# Altium project TSAV Updated UCM ISO.PrjPcb
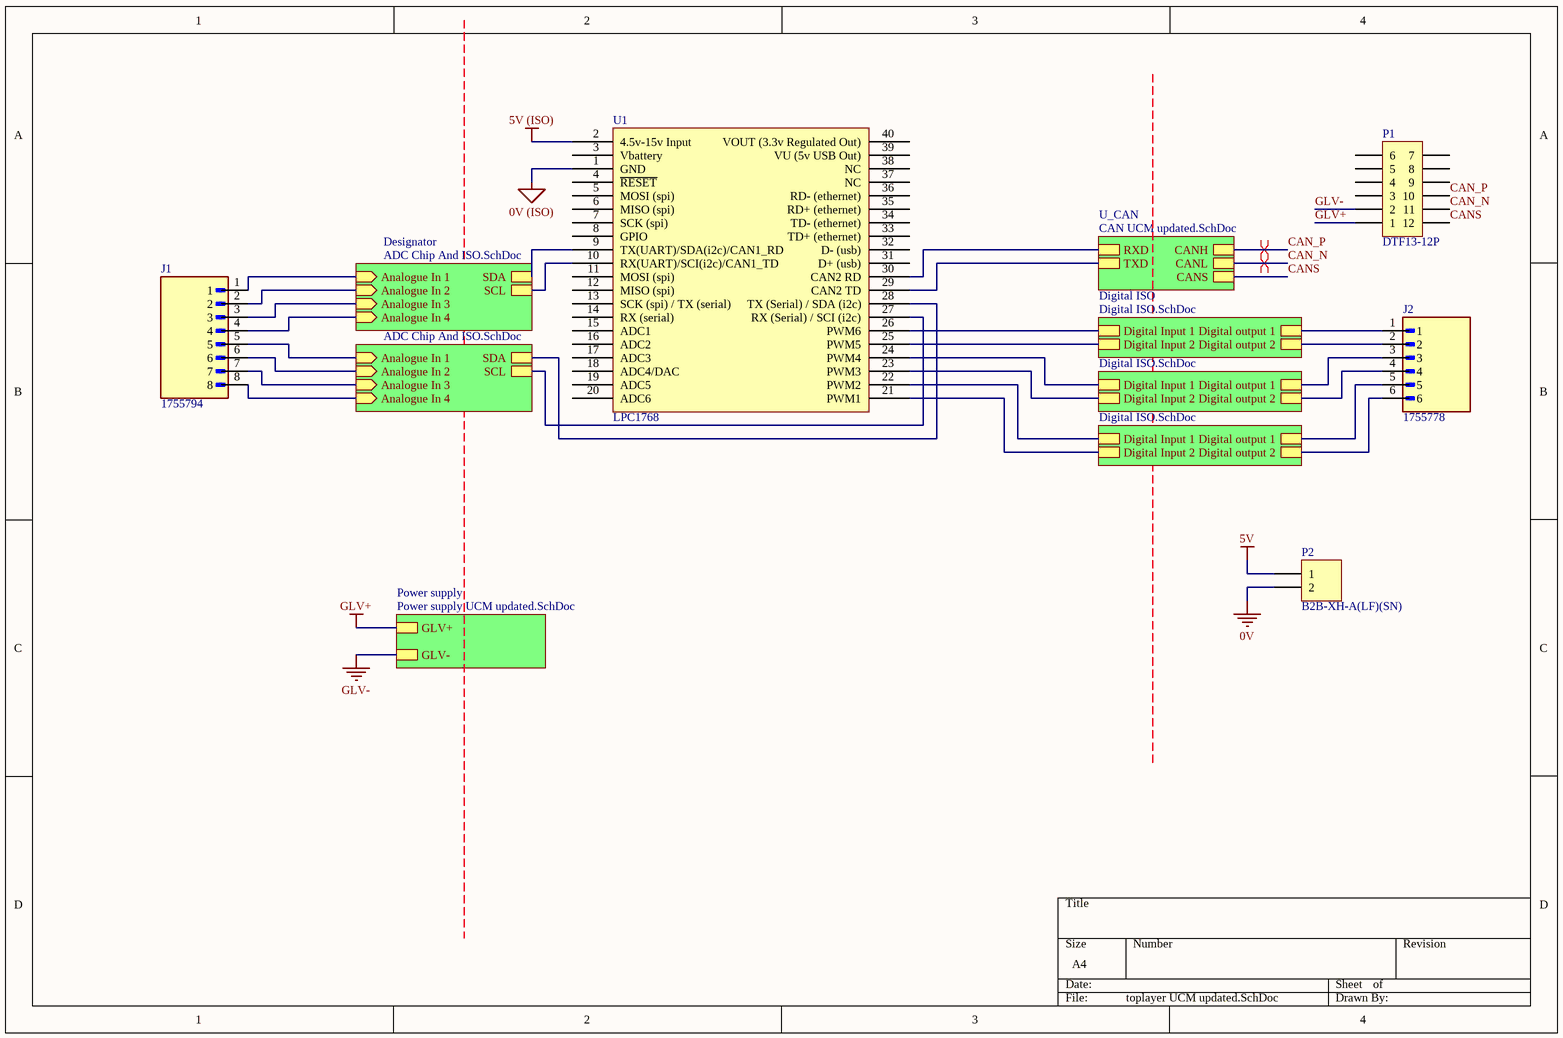
[diagram p0: toplayer UCM updated.SchDoc]
5 sheets, 135 parts. Net scope: hierarchical (ports join the sheet entries above them; power ports are global).
Board file: TSAV UPDATED UCM ISO.PcbDoc
Sheets:
  toplayer UCM updated.SchDoc
    U_CAN = CAN UCM updated.SchDoc
    Power supply = Power supply UCM updated.SchDoc
    Designator = Digital ISO.SchDoc
    Designator = ADC Chip And ISO.SchDoc
    Designator = ADC Chip And ISO.SchDoc
    Digital ISO = Digital ISO.SchDoc
    Digital ISO = Digital ISO.SchDoc

## Sheet toplayer UCM updated.SchDoc
size A4; SheetNumber: 1; SheetTotal: 5

### Parts
J1  1755794  [PHOENIX_1755794]
J2  1755778  [PHOENIX_1755778]
P1  DTF13-12P  [DTF13-12P]
P2  B2B-XH-A(LF)(SN)  [XH 2 PIN VERT]
U1  LPC1768  [LPC1768]

### Sub-sheets
Designator = Digital ISO.SchDoc: Digital Input 1, Digital Input 2, Digital output 1, Digital output 2
Designator = ADC Chip And ISO.SchDoc: Analogue In 1 (in), Analogue In 2 (in), SDA, SCL, Analogue In 3 (in), Analogue In 4 (in)
Designator = ADC Chip And ISO.SchDoc: Analogue In 1 (in), Analogue In 2 (in), SDA, SCL, Analogue In 3 (in), Analogue In 4 (in)
Digital ISO = Digital ISO.SchDoc: Digital Input 1, Digital Input 2, Digital output 1, Digital output 2
Digital ISO = Digital ISO.SchDoc: Digital Input 1, Digital Input 2, Digital output 1, Digital output 2
Power supply = Power supply UCM updated.SchDoc: GLV+, GLV-
U_CAN = CAN UCM updated.SchDoc: RXD, TXD, CANH, CANL, CANS

### Nets
0V: P2.2
0V (ISO): U1.1(GND)
5V: P2.1
5V (ISO): U1.2(4.5v-15v_Input)
GLV+: P1.1 ; sheet Power supply/GLV+
GLV-: P1.2 ; sheet Power supply/GLV-
CAN_N: P1.11 ; sheet U_CAN/CANL
CAN_P: P1.10 ; sheet U_CAN/CANH
CANS: P1.12 ; sheet U_CAN/CANS
NetC33_Designator#1_2: J1.1 ; sheet Designator/Analogue In 1
NetC33_Designator#2_2: J1.5 ; sheet Designator/Analogue In 1
NetC34_Designator#1_2: J1.2 ; sheet Designator/Analogue In 2
NetC34_Designator#2_2: J1.6 ; sheet Designator/Analogue In 2
NetC35_Designator#1_2: J1.4 ; sheet Designator/Analogue In 4
NetC35_Designator#2_2: J1.8 ; sheet Designator/Analogue In 4
NetC36_Designator#1_2: J1.3 ; sheet Designator/Analogue In 3
NetC36_Designator#2_2: J1.7 ; sheet Designator/Analogue In 3
NetJ2_1: J2.1 ; sheet Digital ISO/Digital output 1
NetJ2_2: J2.2 ; sheet Digital ISO/Digital output 2
NetJ2_3: J2.3 ; sheet Digital ISO/Digital output 1
NetJ2_4: J2.4 ; sheet Digital ISO/Digital output 2
NetJ2_5: J2.5 ; sheet Designator/Digital output 1
NetJ2_6: J2.6 ; sheet Designator/Digital output 2
NetR7_Designator_1: U1.22(PWM2) ; sheet Designator/Digital Input 1
NetR7_Digital_ISO#1_1: U1.24(PWM4) ; sheet Digital ISO/Digital Input 1
NetR7_Digital_ISO#2_1: U1.26(PWM6) ; sheet Digital ISO/Digital Input 1
NetR8_Designator#1_1: U1.9(TX(UART)/SDA(i2c)/CAN1_RD) ; sheet Designator/SDA
NetR8_Designator#2_1: U1.28(TX_(Serial)_/_SDA_(i2c)) ; sheet Designator/SDA
NetR9_Designator#1_1: U1.10(RX(UART)/SCI(i2c)/CAN1_TD) ; sheet Designator/SCL
NetR9_Designator#2_1: U1.27(RX_(Serial)_/_SCI_(i2c)) ; sheet Designator/SCL
NetR26_Designator_1: U1.21(PWM1) ; sheet Designator/Digital Input 2
NetR26_Digital_ISO#1_1: U1.23(PWM3) ; sheet Digital ISO/Digital Input 2
NetR26_Digital_ISO#2_1: U1.25(PWM5) ; sheet Digital ISO/Digital Input 2
NetU1_29: U1.29(CAN2_TD) ; sheet U_CAN/TXD
NetU1_30: U1.30(CAN2_RD) ; sheet U_CAN/RXD

Not connected (* = marked no-connect by the designer): P1 3 4 5 6 7 8 9; U1 3(Vbattery) 4(~{RESET}) 5(MOSI_(spi)) 6(MISO_(spi)) 7(SCK_(spi)) 8(GPIO) 11(MOSI_(spi)) 12(MISO_(spi)) 13(SCK_(spi)_/_TX_(serial)) 14(RX_(serial)) 15(ADC1) 16(ADC2) 17(ADC3) 18(ADC4/DAC) 19(ADC5) 20(ADC6) 31(D+_(usb)) 32(D-_(usb)) 33(TD+_(ethernet)) 34(TD-_(ethernet)) 35(RD+_(ethernet)) 36(RD-_(ethernet)) 37(NC) 38(NC) 39(VU_(5v_USB_Out)) 40(VOUT_(3.3v_Regulated_Out))

### Layout directives
differential pair: CAN_N, CAN_P

### Library data of the parts
J1 = 1755794: Pluggable Header 5.08mm 12AWG 320V 12A 8 Position COMBICON MSTBVA Series | Phoenix Contact 1755794; SnapEDA_Link: https://www.snapeda.com/parts/1755794/Phoenix+Contact/view-part/?ref=snap; Package: None; Value: *; MF: Phoenix Contact; MP: 1755794; Check_prices: https://www.snapeda.com/parts/1755794/Phoenix+Contact/view-part/?ref=eda
J2 = 1755778: Pluggable Header 5.08mm 12AWG 320V 12A 6 Position COMBICON MSTBVA Series | Phoenix Contact 1755778; SnapEDA_Link: https://www.snapeda.com/parts/1755778/Phoenix+Contact/view-part/?ref=snap; Package: None; Value: *; MF: Phoenix Contact; MP: 1755778; Check_prices: https://www.snapeda.com/parts/1755778/Phoenix+Contact/view-part/?ref=eda
P1 = DTF13-12P: Positions: 12; Pitch: 4.45mm; Angle: 90; Flange: No; Contact: Copper Alloy; Part Number: DTF13-12P; Row Spacing: 4.45mm; Digikey Part Number: 1734-1861-ND; Digikey Link: https://www.digikey.com/products/en?keywords=dtf13-12pa
P2 = B2B-XH-A(LF)(SN): Positions: 2; Pitch: 2.54mm; Angle: 0; Flange: No; Contact: Tin; Part Number: B2B-XH-A(LF)(SN); Row Spacing: 2.54mm; Digikey Part Number: 455-2247-ND; Digikey Link: https://www.digikey.com.au/en/products/detail/jst-sales-america-inc/B2B-XH-A-LF-SN/1651045
U1 = LPC1768: Mbed Development Board LPC1768; Complex IC: 1; Part Number: LPC1768; Manufacturer: MBED

## Sheet CAN UCM updated.SchDoc
size A4; SheetNumber: 2; SheetTotal: 5
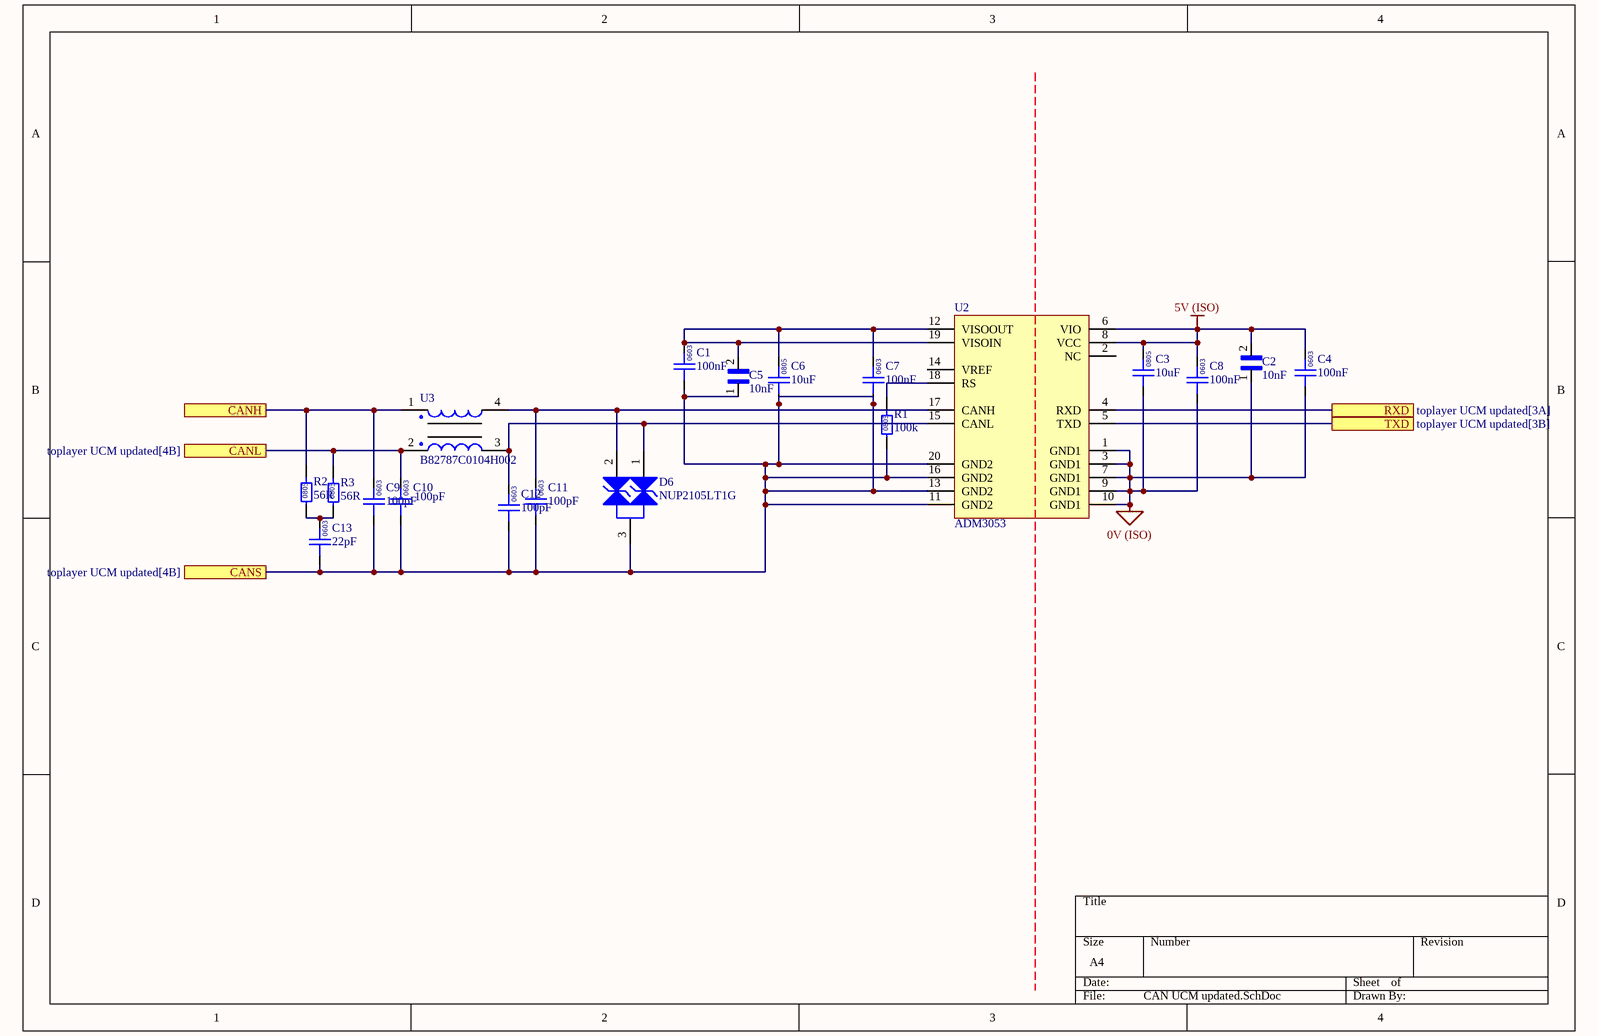
[diagram p1: CAN UCM updated.SchDoc]

### Parts
C1  100nF  [0603]
C2  10nF  [CAPC3216X95N]
C3  10uF  [0805]
C4  100nF  [0603]
C5  10nF  [CAPC3216X95N]
C6  10uF  [0805]
C7  100nF  [0603]
C8  100nF  [0603]
C9  100pF  [0603]
C10  100pF  [0603]
C11  100pF  [0603]
C12  100pF  [0603]
C13  22pF  [0603]
D6  NUP2105LT1G  [ONSC-SOT-23-3-318-08_V]
R1  100k  [0805]
R2  56R  [0805]
R3  56R  [0805]
U2  ADM3053  [AD SOIC-W 20]
U3  B82787C0104H002  [TDK 4-PC Pad]

### Ports
CANH (see toplayer UCM updated[4A]), CANL (see toplayer UCM updated[4B]), CANS (see toplayer UCM updated[4B]), RXD (see toplayer UCM updated[3A]), TXD (see toplayer UCM updated[3B])

### Nets
0V (ISO): C2.1 C3.1 C4.1 C8.1 U2.1(GND1) U2.3(GND1) U2.7(GND1) U2.9(GND1) U2.10(GND1)
5V (ISO): C2.2 C3.2 C4.2 C8.2 U2.6(VIO) U2.8(VCC)
CAN_N: C10.2 R3.2 U3.2 ; port CANL
CAN_P: C9.2 R2.2 U3.1 ; port CANH
CANS: C1.1 C5.1 C6.1 C7.1 C9.1 C10.1 C11.1 C12.1 C13.1 D6.3(K) R1.1 U2.11(GND2) U2.13(GND2) U2.16(GND2) U2.20(GND2) ; port CANS
NetC1_2: C1.2 C5.2 C6.2 C7.2 U2.12(VISOOUT) U2.19(VISOIN)
NetC11_2: C11.2 D6.2(K) U2.17(CANH) U3.4
NetC12_2: C12.2 D6.1(K) U2.15(CANL) U3.3
NetC13_2: C13.2 R2.1 R3.1
NetR1_2: R1.2 U2.18(RS)
NetU1_29: U2.5(TXD) ; port TXD
NetU1_30: U2.4(RXD) ; port RXD

Not connected (* = marked no-connect by the designer): U2 2(NC) 14(VREF)

### Notes on the sheet
- (in symbol GCM188L81H104KA57D) 0603
- (in symbol GRM21BR6YA106KE43L) 0805
- (in symbol GRM0335C1H220JA01D) 0603
- (in symbol GRM1885C1H101JA01D) 0603
- (in symbol RC0805FR0756RL) 0805
- (in symbol RC0805FR07100KL) 0805

### Library data of the parts
C1 C4 C7 C8 = GCM188L81H104KA57D: Manufacturer: muRata; Rated Voltage: 50V; Tolerance: ±10%; Material: MLCC; Temperature Rating: X8L; Part Number: GCM188L81H104KA57D; Value: 100nF; Digikey Part Number: 490-6049-1-ND
C2 C5 = GCM3195C2A103JA16D: 1206 0.01 uF 100 V Â±5% Tolerance C0G SMT Multilayer Ceramic Capacitor; MF: Murata Electronics; Check_prices: https://www.snapeda.com/parts/GCM3195C2A103JA16D/Murata%20Electronics%20North%20America/view-part/1773285/?ref=eda; Package: 3216 Murata; MP: GCM3195C2A103JA16D; Value: *; Availability: In Stock; SnapEDA_Link: https://www.snapeda.com/parts/GCM3195C2A103JA16D/Murata%20Electronics%20North%20America/view-part/1773285/?ref=snap; Price: None
C3 C6 = GRM21BR6YA106KE43L: Manufacturer: muRata; Rated Voltage: 50V; Tolerance: 10%; Material: MLCC; Temperature Rating: X5R; Part Number: GRM21BR6YA106KE43L; Value: 10uF; Digikey Part Number: 490-10514-6-ND
C9-C12 = GRM1885C1H101JA01D: Manufacturer: Murata Electronics; Rated Voltage: 50V; Tolerance: ±5%; Material: MLCC; Temperature Rating: C0G, NP0; Part Number: GRM1885C1H101JA01D; Value: 100pF; Digikey Part Number: 490-1427-1-ND
C13 = GRM0335C1H220JA01D: Manufacturer: Murata Electronics; Rated Voltage: 50V; Tolerance: ±5%; Material: MLCC; Temperature Rating: C0G, NP0; Part Number: GRM0335C1H220JA01D; Value: 22pF; Digikey Part Number: 490-6123-1-ND
D6 = CMP-1063-00164-1: Dual Line CAN Bus Protector, 3-Pin SOT-23, Pb-Free, Tape and Reel; Manufacturer: On Semiconductor; IR Max (uA): 0.1; Number of Lines: 2; Direction: Bidirectional; C Max (pF): 30; PPK Max (W): 350; V(BR) Min (V): 26.2; ComponentLink3URL: http://www.onsemi.cn/pub_link/Collateral/318-08.PDF; Mounting Technology: Surface Mount; ComponentLink2Description: Datasheet; PartNumber: NUP2105LT1G; ComponentLink1URL: http://www.onsemi.com/; PackageVersion: Rev. AP, 11/2009; DatasheetVersion: Rev. 5; RoHS: Pb-Free; PackageReference: SOT-23-3-318-08; ComponentLink2URL: http://www.onsemi.cn/pub_link/Collateral/NUP2105L-D.PDF; ComponentLink1Description: Manufacturer URL; PackageDescription: 3-Pin Small Outline Transistor, Body 2.92 x 1.3 mm, Pitch 0.95 mm; Packing: Tape and Reel; ComponentLink3Description: Package Specification
R1 = RC0805FR07100KL: Manufacturer: YAGEO; Tolerance: 0.01; Rated Power: 0.125W; Part Number: RC0805FR07100KL; Value: 100k; Material: FR-07; Digikey Part Number: 311-100KCRCT-ND
R2 R3 = RC0805FR0756RL: Manufacturer: YAGEO; Tolerance: 0.01; Rated Power: 0.125W; Part Number: RC0805FR0756RL; Value: 56R; Material: FR-07; Digikey Part Number: 311-56.0CRCT-ND
U2 = ADM3053: Isolated CAN Transceiver; Manufacturer: Analogue Devices; Complex IC: 1; Part Number: ADM3053; Digikey Part Number: ADM3053BRWZ-ND; Digikey Link: https://www.digikey.com/product-detail/en/analog-devices-inc/ADM3053BRWZ/ADM3053BRWZ-ND/2709332
U3 = B82787C0104H002: Manufacturer: EPCOS (TDK); Value: 100µH @ 100kHz; Impedance: 5.8 kOhms @ 10MHz; Rated Current: 150mA; Part Number: B82787C0104H002; Material: Wirewound; Digikey Part Number: 495-4598-1-ND

## Sheet Power supply UCM updated.SchDoc
size A4; SheetNumber: 3; SheetTotal: 5
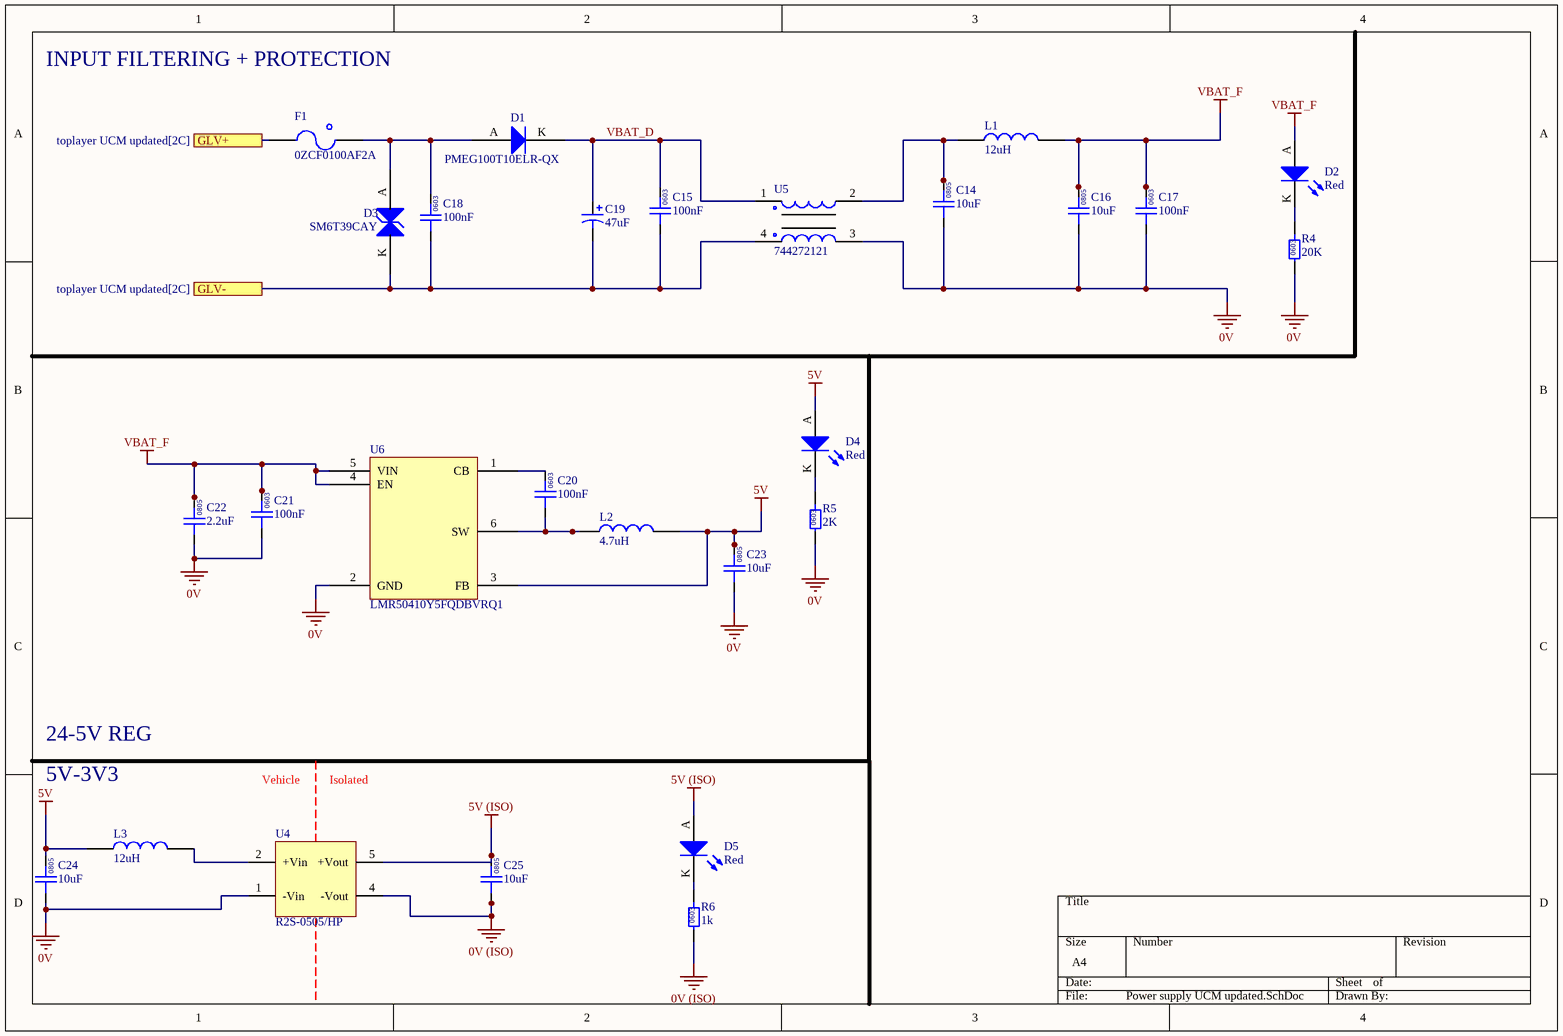
[diagram p2: Power supply UCM updated.SchDoc]

### Parts
C14  10uF  [0805]
C15  100nF  [0603]
C16  10uF  [0805]
C17  100nF  [0603]
C18  100nF  [0603]
C19  47uF  [CHEMI-CON ELCO]
C20  100nF  [0603]
C21  100nF  [0603]
C22  2.2uF  [0805]
C23  10uF  [0805]
C24  10uF  [0805]
C25  10uF  [0805]
D1  PMEG100T10ELR-QX  [SODFL350X110-2N]
D2  Red  [0805 LED]
D3  SM6T39CAY  [SM6T39CAY-Footprint-1]
D4  Red  [0805 LED]
D5  Red  [0805 LED]
F1  0ZCF0100AF2A  [2920]
L1  12uH  [1812]
L2  4.7uH  [SRN3015TA-4R7M]
L3  12uH  [1812]
R4  20K  [0603]
R5  2K  [0603]
R6  1k  [0603]
U4  R2S-0505/HP  [RECOM 8-SMD (5 Pin)]
U5  744272121  [Wurth 4-PC Pad]
U6  LMR50410Y5FQDBVRQ1  [TI-SOT23-6]

### Ports
GLV+ (see toplayer UCM updated[2C]), GLV- (see toplayer UCM updated[2C])

### Nets
0V: C14.1 C16.1 C17.1 C21.1 C22.1 C23.1 C24.1 R4.1 R5.1 U4.1(-Vin) U5.3 U6.2(GND)
0V (ISO): C25.1 R6.1 U4.4(-Vout)
5V: C23.2 C24.2 D4.A L2.1 L3.2 U6.3(FB)
5V (ISO): C25.2 D5.A U4.5(+Vout)
GLV+: F1.1 ; port GLV+
GLV-: C15.1 C18.1 C19.1 D3.K U5.4 ; port GLV-
VBAT_F: C16.2 C17.2 C21.2 C22.2 D2.A L1.1 U6.4(EN) U6.5(VIN)
VBAT_D: C15.2 C19.2 D1.K U5.1
NetC14_2: C14.2 L1.2 U5.2
NetC18_2: C18.2 D1.A D3.A F1.2
NetC20_1: C20.1 L2.2 U6.6(SW)
NetC20_2: C20.2 U6.1(CB)
NetD2_K: D2.K R4.2
NetD4_K: D4.K R5.2
NetD5_K: D5.K R6.2
NetL3_1: L3.1 U4.2(+Vin)

### Notes on the sheet
- INPUT FILTERING + PROTECTION
- 24-5V REG
- 5V-3V3
- Vehicle
- Isolated
- (in symbol GCM188L81H104KA57D) 0603
- (in symbol GRM21BR6YA106KE43L) 0805
- (in symbol GRM21BR61A226ME51L) 0805
- (in symbol RC0603FR-071KL) 0603
- (in symbol RC0603FR-072KL) 0603
- (in symbol RC0603FR-0720KL) 0603

### Library data of the parts
C14 C16 C23-C25 = GRM21BR6YA106KE43L: as C3 on sheet CAN UCM updated; Part Number: GRM21BR6YA106KE43L; Value: 10uF; Digikey Part Number: 490-10514-6-ND
C15 C17 C18 C20 C21 = GCM188L81H104KA57D: as C1 on sheet CAN UCM updated; Part Number: GCM188L81H104KA57D; Value: 100nF; Digikey Part Number: 490-6049-1-ND
C19 = HHXA350ARA470MF61G: Part Number: HHXA350ARA470MF61G
C22 = GRM21BR61A226ME51L: Manufacturer: muRata; Value: 22uF; Rated Voltage: 50V; Tolerance: 20%; Material: MLCC; Temperature Rating: X5R; Part Number: GRM21BR61A226ME51L; Digikey Part Number: 490-10511-1-ND
D1 = CMP-004-00005-4: Diode 100 V 1A Surface Mount SOD-123W
D2 D4 D5 = SML-210LTT86: Red LED Indication - Discrete 1.75V 0805 (2012 Metric); Manufacturer: ROHM Semiconductor; Part Number: SML-210LTT86; Colour: Red; Digikey Part Number: 511-1286-1-ND
D3 = CMP-004-00003-4: TVS Diode Single Bi-Dir 33.3V 600W Automotive 2-Pin SMB T/R / TVS DIODE 33.3VWM 69.7VC SMB; Peak Pulse Current: 57A; Polarity: Bidirectional; Min Breakdown Voltage: 37.1V; Test Current: 1mA; Number of Elements: 1; Operating Supply Voltage: 30V; Diode Type: ZENER; Clamping Voltage: 53.9V; Leakage Current: 200nA; Power Line Protection: No; Max Surge Current: 11.1A; Max Breakdown Voltage: 41V; Breakdown Voltage: 39V; Max Power Dissipation: 600W; Radiation Hardening: No; Resistor Type: Zener; Termination: SMD/SMT; REACH SVHC: No SVHC; Reverse Breakdown Voltage: 37.1V; Max Operating Temperature: 150°C; Min Operating Temperature: -55°C; Element Configuration: Single; Length: 4.6mm; Case/Package: DO-214AA; Reverse Standoff Voltage: 33.3V; Number of Bidirectional Channels: 1; Number of Pins: 2; Direction: Bidirectional; Mount: Surface Mount; Package Quantity: 1; Width: 3.95mm; RoHS Compliant: Yes; Number of Channels: 1; Packaging: Tape and Reel; Max Reverse Leakage Current: 200nA; Peak Pulse Power: 600W; Height: 2.45mm; Series: Automotive, AEC-Q101, SM6TY, TRANSIL™
F1 = 0ZCF0100AF2A: PTC RESET FUSE 60V 1A 292; Manufacturer: Littelfuse Inc.; Part Number: 0ZCF0100AF2A; Digikey Part Number: 507-2070-1-ND; Digikey Link: https://www.digikey.com/product-detail/en/bel-fuse-inc/0ZCF0100AF2A/507-2070-1-ND/6210547
L1 L3 = RLS-126: Manufacturer: Recom; Tolerance: 0.2; Impedance: 230mOhm; Rated Current: 0.8 A; Material: Wirewound; Part Number: RLS-126; Value: 12uH; Digikey Part Number: 945-3429-ND
L2 = SRN4018-4R7M: Manufacturer: Bourns; Tolerance: 0.2; Impedance: 84mOhms; Rated Current: 1.9A; Material: Wirewound; Part Number: SRN4018-4R7M; Value: 4.7uH; Digikey Part Number: SRN3015TA-4R7MCT-ND
R4 = RC0603FR-0720KL: Manufacturer: YAGEO; Tolerance: 0.01; Rated Power: 0.1W; Part Number: RC0603FR-0720KL; Value: 20K; Digikey Part Number: 311-20.0KHRCT-ND; Material: FR-07
R5 = RC0603FR-072KL: Manufacturer: YAGEO; Tolerance: 0.01; Rated Power: 0.1W; Part Number: RC0603FR-072KL; Value: 2K; Digikey Part Number: 311-2.00KHRCT-ND; Material: FR-07
R6 = RC0603FR-071KL: Manufacturer: YAGEO; Tolerance: 0.01; Rated Power: 0.1W; Part Number: RC0603FR-071KL; Value: 1k; Digikey Part Number: 311-1.00KHRCT-ND; Material: FR-07
U4 = R2S-0505/HP: Isolated Module DC DC Converter 1 Output 5V 606mA 4.5V - 5.5V Input; Manufacturer: Recom; Output Power: 2W; Efficiency: 0.85; Part Number: R2S-0505/HP; Input Voltage: 4.5V-5.5V; Output Voltage: 5V; Isolation: Isolated; Digikey Part Number: 945-1764-5-ND; Digikey Link: https://www.digikey.com/product-detail/en/recom-power/R2S-0505-HP/945-1764-5-ND/2302761
U5 = 744272121: Manufacturer: Wurth Electronics Inc; Value: 120uH @ 100kHz; Impedance: 460 Ohms @ 30MHz; Rated Current: 2.5 A; Part Number: 744272121; Material: Wirewound; Digikey Part Number: 732-1489-1-ND
U6 = LMR50410-Q1: IC REG BUCK 5V 1A SOT23-6; Manufacturer: Texas Instruments; Input Voltage: 4-36V; Part Number: LMR50410-Q1; Output Voltage: 5V; Output Current: 1A; Digikey Part Number: 296-LMR50410Y5FQDBVRQ1CT-ND

## Sheet Digital ISO.SchDoc
size A4; SheetNumber: 5; SheetTotal: 5
Used 3 times, as channels Designator, Digital ISO, Digital ISO. Parts and nets are listed once, with the designators drawn on the sheet.
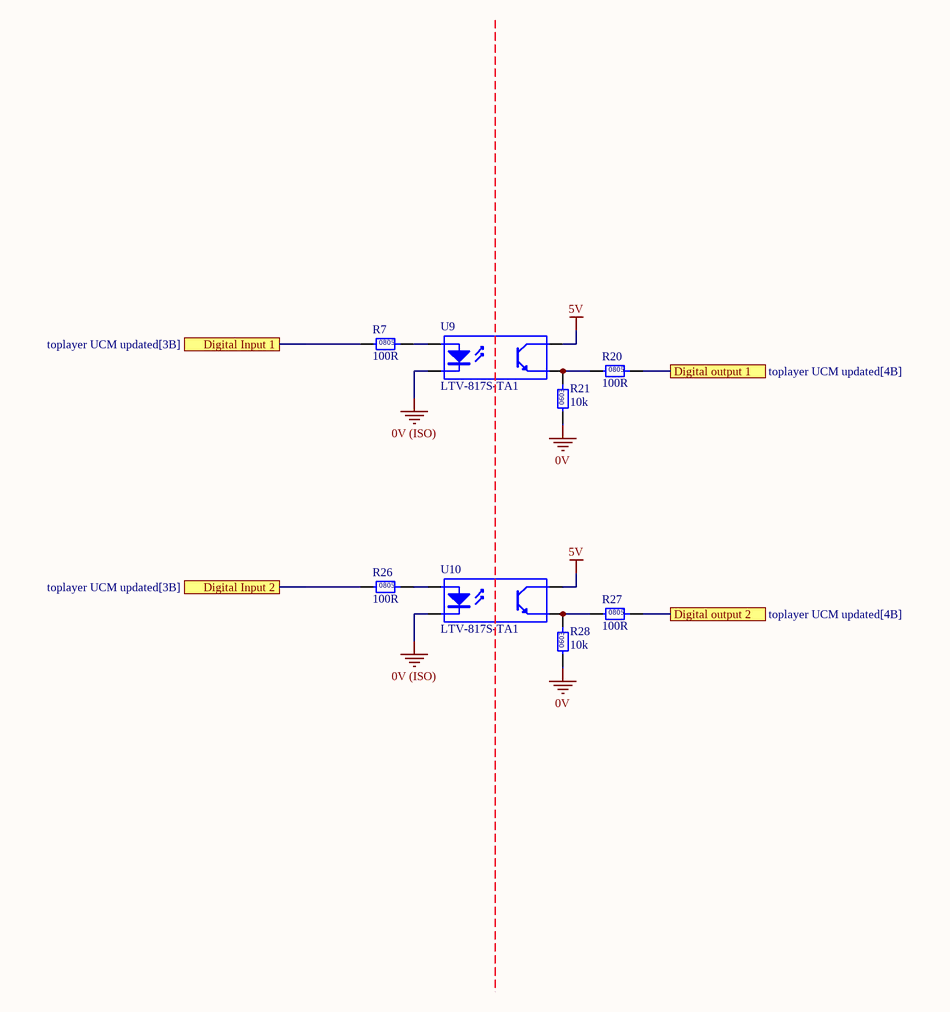
[diagram p3: Digital ISO.SchDoc]

### Parts
R7  100R  [0805]
R20  100R  [0805]
R21  10k  [0603]
R26  100R  [0805]
R27  100R  [0805]
R28  10k  [0603]
U9  LTV-817S-TA1  [ON 4-SMD]
U10  LTV-817S-TA1  [ON 4-SMD]

### Ports
Digital Input 1 (see toplayer UCM updated[3B]), Digital Input 2 (see toplayer UCM updated[3B]), Digital output 1 (see toplayer UCM updated[4B]), Digital output 2 (see toplayer UCM updated[4B])

### Nets
0V: R21.1 R28.1
0V (ISO): U9.2(K) U10.2(K)
5V: U9.4(C) U10.4(C)
Digital Input 1: R7.1 ; port Digital Input 1
Digital Input 2: R26.1 ; port Digital Input 2
Digital output 1: R20.2 ; port Digital output 1
Digital output 2: R27.2 ; port Digital output 2
NetR7_2: R7.2 U9.1(A)
NetR20_1: R20.1 R21.2 U9.3(E)
NetR26_2: R26.2 U10.1(A)
NetR27_1: R27.1 R28.2 U10.3(E)

### Channels
Designator: designators end in _Designator; ports Digital Input 1=NetR7_Designator_1 Digital Input 2=NetR26_Designator_1 Digital output 1=NetJ2_5 Digital output 2=NetJ2_6
Digital ISO: designators end in _Digital_ISO#1; ports Digital Input 1=NetR7_Digital_ISO#1_1 Digital Input 2=NetR26_Digital_ISO#1_1 Digital output 1=NetJ2_3 Digital output 2=NetJ2_4
Digital ISO: designators end in _Digital_ISO#2; ports Digital Input 1=NetR7_Digital_ISO#2_1 Digital Input 2=NetR26_Digital_ISO#2_1 Digital output 1=NetJ2_1 Digital output 2=NetJ2_2

### Notes on the sheet
- (in symbol RC0603FR-0710KL) 0603
- (in symbol RC0805FR07100RL) 0805

### Library data of the parts
R7 R20 R26 R27 = RC0805FR07100RL: Manufacturer: YAGEO; Tolerance: 0.01; Rated Power: 0.125W; Part Number: RC0805FR07100RL; Value: 100R; Material: FR-07; Digikey Part Number: 311-100CRCT-ND
R21 R28 = RC0603FR-0710KL: Manufacturer: YAGEO; Tolerance: 0.01; Rated Power: 0.1W; Part Number: RC0603FR-0710KL; Value: 10k; Material: FR-07; Digikey Part Number: 311-10.0KHRCT-ND
U9 U10 = LTV-817S-TA1: 35V 50ma Optocoupler (VF=1.2V); Manufacturer: Lite-On Inc; Part Number: LTV-817S-TA1; Digikey Part Number: 160-1893-2-ND; Digikey Link: https://www.digikey.com/product-detail/en/lite-on-inc/LTV-817S-TA1/160-1893-2-ND/388451

## Sheet ADC Chip And ISO.SchDoc
size A4; SheetNumber: 4; SheetTotal: 5
Used 2 times, as channels Designator, Designator. Parts and nets are listed once, with the designators drawn on the sheet.
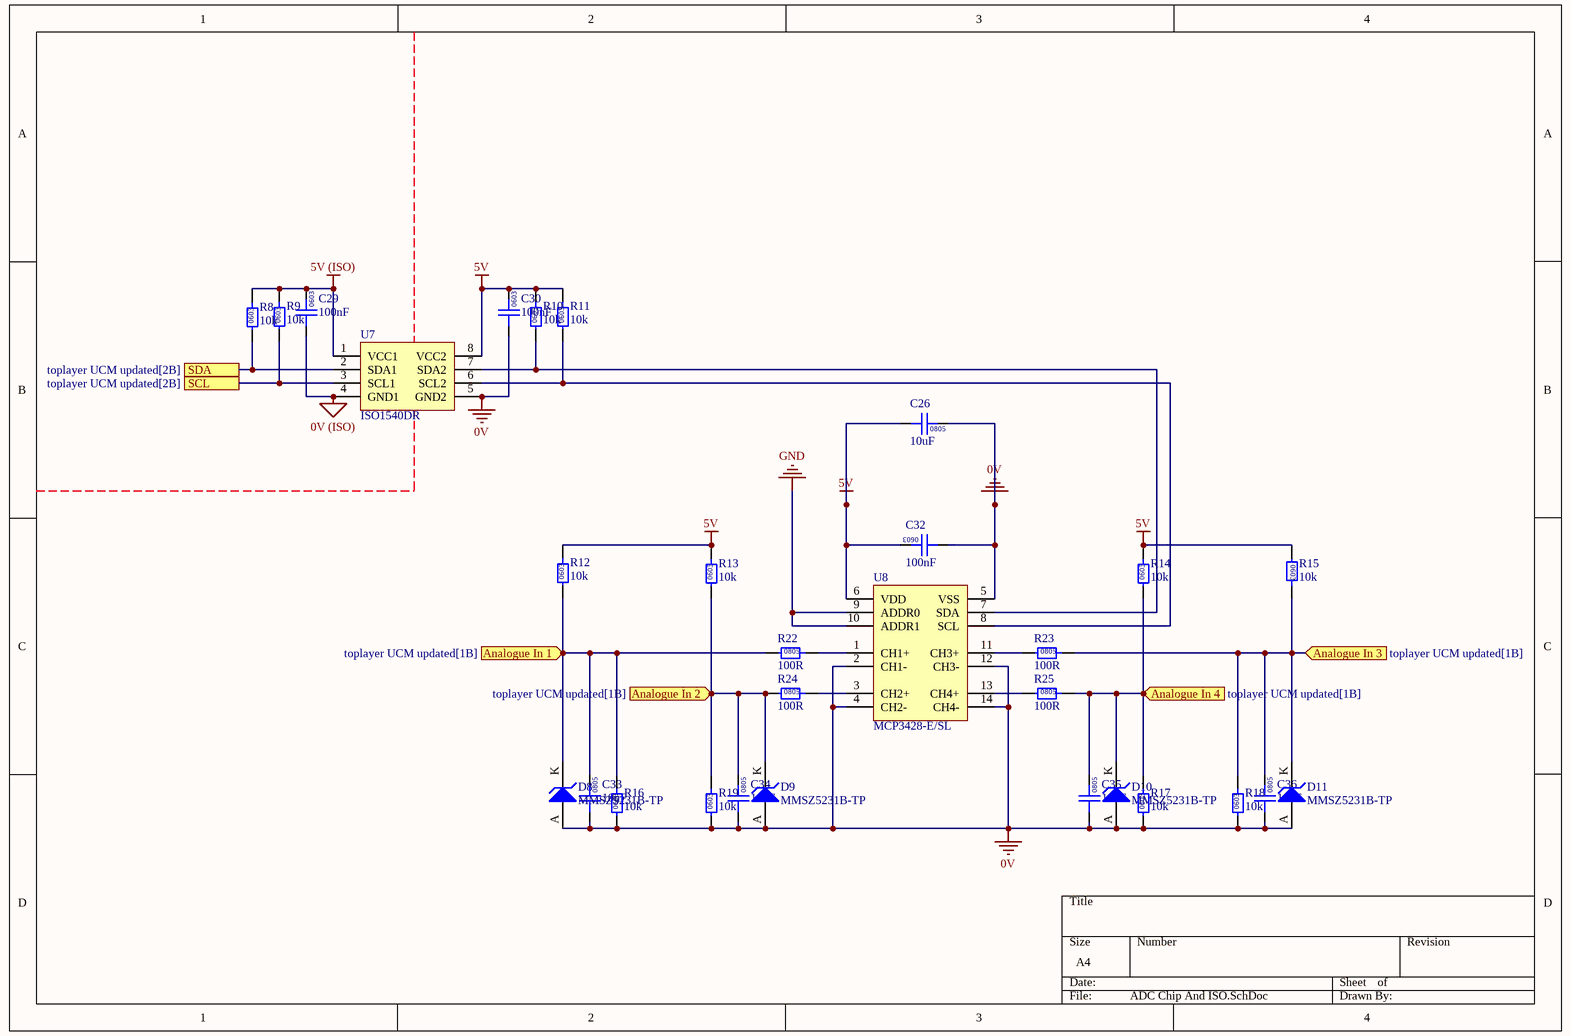
[diagram p4: ADC Chip And ISO.SchDoc]

### Parts
C26  10uF  [0805]
C29  100nF  [0603]
C30  100nF  [0603]
C32  100nF  [0603]
C33  10uF  [0805]
C34  10uF  [0805]
C35  10uF  [0805]
C36  10uF  [0805]
D8  MMSZ5231B-TP  [SOD-123 Diode]
D9  MMSZ5231B-TP  [SOD-123 Diode]
D10  MMSZ5231B-TP  [SOD-123 Diode]
D11  MMSZ5231B-TP  [SOD-123 Diode]
R8  10k  [0603]
R9  10k  [0603]
R10  10k  [0603]
R11  10k  [0603]
R12  10k  [0603]
R13  10k  [0603]
R14  10k  [VB 0207]
R15  10k  [VB 0207]
R16  10k  [0603]
R17  10k  [0603]
R18  10k  [0603]
R19  10k  [0603]
R22  100R  [0805]
R23  100R  [0805]
R24  100R  [0805]
R25  100R  [0805]
U7  ISO1540DR  [TI 8-SOIC]
U8  MCP3428-E/SL  [MC 14-SOIC]

### Ports
Analogue In 1 (in, see toplayer UCM updated[1B]), Analogue In 2 (in, see toplayer UCM updated[1B]), Analogue In 3 (in, see toplayer UCM updated[1B]), Analogue In 4 (in, see toplayer UCM updated[1B]), SCL (see toplayer UCM updated[2B]), SDA (see toplayer UCM updated[2B])

### Nets
0V: C26.2 C30.1 C32.1 C33.1 C34.1 C35.1 C36.1 D8.A D9.A D10.A D11.A R16.1 R17.1 R18.1 R19.1 U7.5(GND2) U8.2(CH1-) U8.4(CH2-) U8.5(VSS) U8.12(CH3-) U8.14(CH4-)
0V (ISO): C29.1 U7.4(GND1)
5V: C26.1 C30.2 C32.2 R10.2 R11.2 R12.2 R13.2 R14.2 R15.1 U7.8(VCC2) U8.6(VDD)
5V (ISO): C29.2 R8.2 R9.2 U7.1(VCC1)
GND: U8.9(ADDR0) U8.10(ADDR1)
Analogue In 1: C33.2 D8.K R12.1 R16.2 R22.1 ; port Analogue In 1
Analogue In 2: C34.2 D9.K R13.1 R19.2 R24.1 ; port Analogue In 2
Analogue In 3: C36.2 D11.K R15.2 R18.2 R23.2 ; port Analogue In 3
Analogue In 4: C35.2 D10.K R14.1 R17.2 R25.2 ; port Analogue In 4
SCL: R9.1 U7.3(SCL1) ; port SCL
SDA: R8.1 U7.2(SDA1) ; port SDA
NetR10_1: R10.1 U7.7(SDA2) U8.7(SDA)
NetR11_1: R11.1 U7.6(SCL2) U8.8(SCL)
NetR22_2: R22.2 U8.1(CH1+)
NetR23_1: R23.1 U8.11(CH3+)
NetR24_2: R24.2 U8.3(CH2+)
NetR25_1: R25.1 U8.13(CH4+)

### Channels
Designator: designators end in _Designator#1; ports Analogue In 1=NetC33_Designator#1_2 Analogue In 2=NetC34_Designator#1_2 Analogue In 3=NetC36_Designator#1_2 Analogue In 4=NetC35_Designator#1_2 SCL=NetR9_Designator#1_1 SDA=NetR8_Designator#1_1
Designator: designators end in _Designator#2; ports Analogue In 1=NetC33_Designator#2_2 Analogue In 2=NetC34_Designator#2_2 Analogue In 3=NetC36_Designator#2_2 Analogue In 4=NetC35_Designator#2_2 SCL=NetR9_Designator#2_1 SDA=NetR8_Designator#2_1

### Notes on the sheet
- (in symbol GCM188L81H104KA57D) 0603
- (in symbol GRM21BR6YA106KE43L) 0805
- (in symbol RC0603FR-0710KL) 0603
- (in symbol RC0805FR07100RL) 0805

### Library data of the parts
C26 C33-C36 = GRM21BR6YA106KE43L: as C3 on sheet CAN UCM updated; Part Number: GRM21BR6YA106KE43L; Value: 10uF; Digikey Part Number: 490-10514-6-ND
C29 C30 C32 = GCM188L81H104KA57D: as C1 on sheet CAN UCM updated; Part Number: GCM188L81H104KA57D; Value: 100nF; Digikey Part Number: 490-6049-1-ND
D8-D11 = MMSZ5231B-TP: Zener Diode 5.1V 500mW ±5% Surface Mount SOD-123; Manufacturer: On Semiconductor; Part Number: MMSZ5231B-TP; Digikey Part Number: MMSZ5231B-TPMSCT-ND; Digikey Link: https://www.digikey.com/product-detail/en/micro-commercial-co/MMSZ5231B-TP/MMSZ5231B-TPMSCT-ND/1793361
R8-R19 = RC0603FR-0710KL: as R21 on sheet Digital ISO; Part Number: RC0603FR-0710KL; Value: 10k; Material: FR-07; Digikey Part Number: 311-10.0KHRCT-ND
R22-R25 = RC0805FR07100RL: as R7 on sheet Digital ISO; Part Number: RC0805FR07100RL; Value: 100R; Material: FR-07; Digikey Part Number: 311-100CRCT-ND
U7 = ISO1540DR: I2C Digital Isolator (Multichannel); Manufacturer: Texas Instruments; Part Number: ISO1540DR; Digikey Part Number: 296-34871-1-ND; Digikey Link: https://www.digikey.com/product-detail/en/texas-instruments/ISO1540DR/296-34871-1-ND/3587214
U8 = MCP3428-E/SL: 4 Channel I2C ADC, 16 bit; Manufacturer: Microchip Technology; Part Number: MCP3428-E/SL; Digikey Part Number: MCP3428-E/SL-ND; Digikey Link: https://www.digikey.com/product-detail/en/microchip-technology/MCP3428-E-SL/MCP3428-E-SL-ND/2179226

## Nets that join several sheets
0V: toplayer UCM updated (P2.2), Power supply UCM updated (12 pins), Designator (R21_Designator.1 R28_Designator.1), Designator (21 pins), Designator (21 pins), Digital ISO (R21_Digital_ISO#1.1 R28_Digital_ISO#1.1), Digital ISO (R21_Digital_ISO#2.1 R28_Digital_ISO#2.1)
0V (ISO): toplayer UCM updated (U1.1), CAN UCM updated (9 pins), Power supply UCM updated (C25.1 R6.1 U4.4), Designator (U9_Designator.2 U10_Designator.2), Designator (C29_Designator#1.1 U7_Designator#1.4), Designator (C29_Designator#2.1 U7_Designator#2.4), Digital ISO (U9_Digital_ISO#1.2 U10_Digital_ISO#1.2), Digital ISO (U9_Digital_ISO#2.2 U10_Digital_ISO#2.2)
5V: toplayer UCM updated (P2.1), Power supply UCM updated (6 pins), Designator (U9_Designator.4 U10_Designator.4), Designator (11 pins), Designator (11 pins), Digital ISO (U9_Digital_ISO#1.4 U10_Digital_ISO#1.4), Digital ISO (U9_Digital_ISO#2.4 U10_Digital_ISO#2.4)
5V (ISO): toplayer UCM updated (U1.2), CAN UCM updated (6 pins), Power supply UCM updated (C25.2 D5.A U4.5), Designator (C29_Designator#1.2 R8_Designator#1.2 R9_Designator#1.2 U7_Designator#1.1), Designator (C29_Designator#2.2 R8_Designator#2.2 R9_Designator#2.2 U7_Designator#2.1)
GLV+: toplayer UCM updated (P1.1), Power supply UCM updated (F1.1)
GLV-: toplayer UCM updated (P1.2), Power supply UCM updated (5 pins)
GND: Designator (U8_Designator#1.9 U8_Designator#1.10), Designator (U8_Designator#2.9 U8_Designator#2.10)
CAN_N: toplayer UCM updated (P1.11), CAN UCM updated (C10.2 R3.2 U3.2)
CAN_P: toplayer UCM updated (P1.10), CAN UCM updated (C9.2 R2.2 U3.1)
CANS: toplayer UCM updated (P1.12), CAN UCM updated (15 pins)
NetC33_Designator#1_2: toplayer UCM updated (J1.1), Designator (5 pins)
NetC33_Designator#2_2: toplayer UCM updated (J1.5), Designator (5 pins)
NetC34_Designator#1_2: toplayer UCM updated (J1.2), Designator (5 pins)
NetC34_Designator#2_2: toplayer UCM updated (J1.6), Designator (5 pins)
NetC35_Designator#1_2: toplayer UCM updated (J1.4), Designator (5 pins)
NetC35_Designator#2_2: toplayer UCM updated (J1.8), Designator (5 pins)
NetC36_Designator#1_2: toplayer UCM updated (J1.3), Designator (5 pins)
NetC36_Designator#2_2: toplayer UCM updated (J1.7), Designator (5 pins)
NetJ2_1: toplayer UCM updated (J2.1), Digital ISO (R20_Digital_ISO#2.2)
NetJ2_2: toplayer UCM updated (J2.2), Digital ISO (R27_Digital_ISO#2.2)
NetJ2_3: toplayer UCM updated (J2.3), Digital ISO (R20_Digital_ISO#1.2)
NetJ2_4: toplayer UCM updated (J2.4), Digital ISO (R27_Digital_ISO#1.2)
NetJ2_5: toplayer UCM updated (J2.5), Designator (R20_Designator.2)
NetJ2_6: toplayer UCM updated (J2.6), Designator (R27_Designator.2)
NetR7_Designator_1: toplayer UCM updated (U1.22), Designator (R7_Designator.1)
NetR7_Digital_ISO#1_1: toplayer UCM updated (U1.24), Digital ISO (R7_Digital_ISO#1.1)
NetR7_Digital_ISO#2_1: toplayer UCM updated (U1.26), Digital ISO (R7_Digital_ISO#2.1)
NetR8_Designator#1_1: toplayer UCM updated (U1.9), Designator (R8_Designator#1.1 U7_Designator#1.2)
NetR8_Designator#2_1: toplayer UCM updated (U1.28), Designator (R8_Designator#2.1 U7_Designator#2.2)
NetR9_Designator#1_1: toplayer UCM updated (U1.10), Designator (R9_Designator#1.1 U7_Designator#1.3)
NetR9_Designator#2_1: toplayer UCM updated (U1.27), Designator (R9_Designator#2.1 U7_Designator#2.3)
NetR26_Designator_1: toplayer UCM updated (U1.21), Designator (R26_Designator.1)
NetR26_Digital_ISO#1_1: toplayer UCM updated (U1.23), Digital ISO (R26_Digital_ISO#1.1)
NetR26_Digital_ISO#2_1: toplayer UCM updated (U1.25), Digital ISO (R26_Digital_ISO#2.1)
NetU1_29: toplayer UCM updated (U1.29), CAN UCM updated (U2.5)
NetU1_30: toplayer UCM updated (U1.30), CAN UCM updated (U2.4)